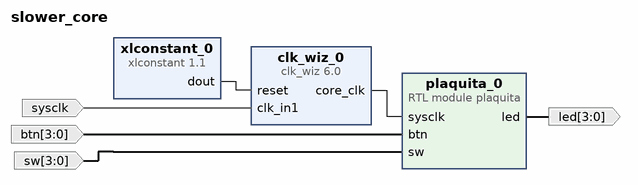
[diagram p0: block diagram of the top level]
# Vivado block design slower_core, xc7z020clg400-1, Vivado 2023.1
create_bd_design slower_core

create_bd_port -dir I -type clk sysclk
set_property -dict {CONFIG.FREQ_HZ 125000000} [get_bd_ports sysclk]
create_bd_port -dir I -from 3 -to 0 sw
create_bd_port -dir I -from 3 -to 0 btn
create_bd_port -dir O -from 3 -to 0 led

create_bd_cell -type ip -vlnv xilinx.com:ip:clk_wiz:6.0 clk_wiz_0
set_property -dict [list \
  CONFIG.CLKIN1_JITTER_PS 100.0 \
  CONFIG.CLKOUT1_JITTER 290.478 \
  CONFIG.CLKOUT1_PHASE_ERROR 133.882 \
  CONFIG.CLKOUT1_REQUESTED_OUT_FREQ 10.000 \
  CONFIG.CLK_OUT1_PORT core_clk \
  CONFIG.MMCM_CLKFBOUT_MULT_F 8.000 \
  CONFIG.MMCM_CLKIN1_PERIOD 8.000 \
  CONFIG.MMCM_CLKOUT0_DIVIDE_F 100.000 \
  CONFIG.MMCM_DIVCLK_DIVIDE 1 \
] [get_bd_cells clk_wiz_0]
create_bd_cell -type ip -vlnv xilinx.com:ip:xlconstant:1.1 xlconstant_0
set_property -dict {CONFIG.CONST_VAL 0} [get_bd_cells xlconstant_0]
create_bd_cell -type module -reference plaquita plaquita_0

# ---- connections ----

connect_bd_net [get_bd_ports btn] [get_bd_pins plaquita_0/btn]
connect_bd_net [get_bd_pins clk_wiz_0/core_clk] [get_bd_pins plaquita_0/sysclk]
connect_bd_net -net plaquita_led [get_bd_pins plaquita_0/led] [get_bd_ports led]
connect_bd_net [get_bd_ports sw] [get_bd_pins plaquita_0/sw]
connect_bd_net -net sysclk_125MHz [get_bd_ports sysclk] [get_bd_pins clk_wiz_0/clk_in1]
connect_bd_net [get_bd_pins xlconstant_0/dout] [get_bd_pins clk_wiz_0/reset]

validate_bd_design
save_bd_design
